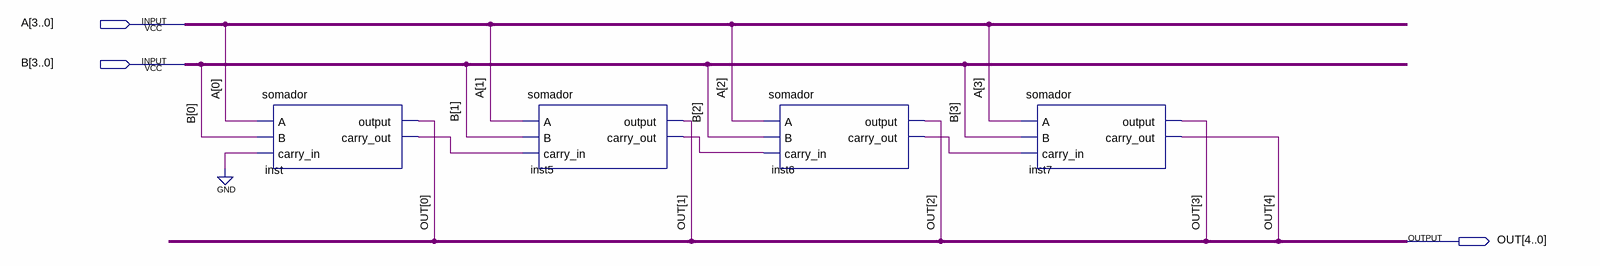
[diagram p0: schematic sheet]
// Quartus schematic SOMADORES.bdf as structural Verilog: 4 symbols, 3 pins
module SOMADORES (
  input  [3:0] A,
  input  [3:0] B,
  output [4:0] OUT
);

  wire inst5_carry_out, inst6_carry_out, inst_carry_out;

  somador inst (.A(A[0]), .B(B[0]), .carry_in(1'b0), .\output (OUT[0]), .carry_out(inst_carry_out));
  somador inst5 (.A(A[1]), .B(B[1]), .carry_in(inst_carry_out), .\output (OUT[1]), .carry_out(inst5_carry_out));
  somador inst6 (.A(A[2]), .B(B[2]), .carry_in(inst5_carry_out), .\output (OUT[2]), .carry_out(inst6_carry_out));
  somador inst7 (.A(A[3]), .B(B[3]), .carry_in(inst6_carry_out), .\output (OUT[3]), .carry_out(OUT[4]));
endmodule
